# Altium schematic sheet Schematic_nanopad-retro.schdoc
size 410 x 288 mm
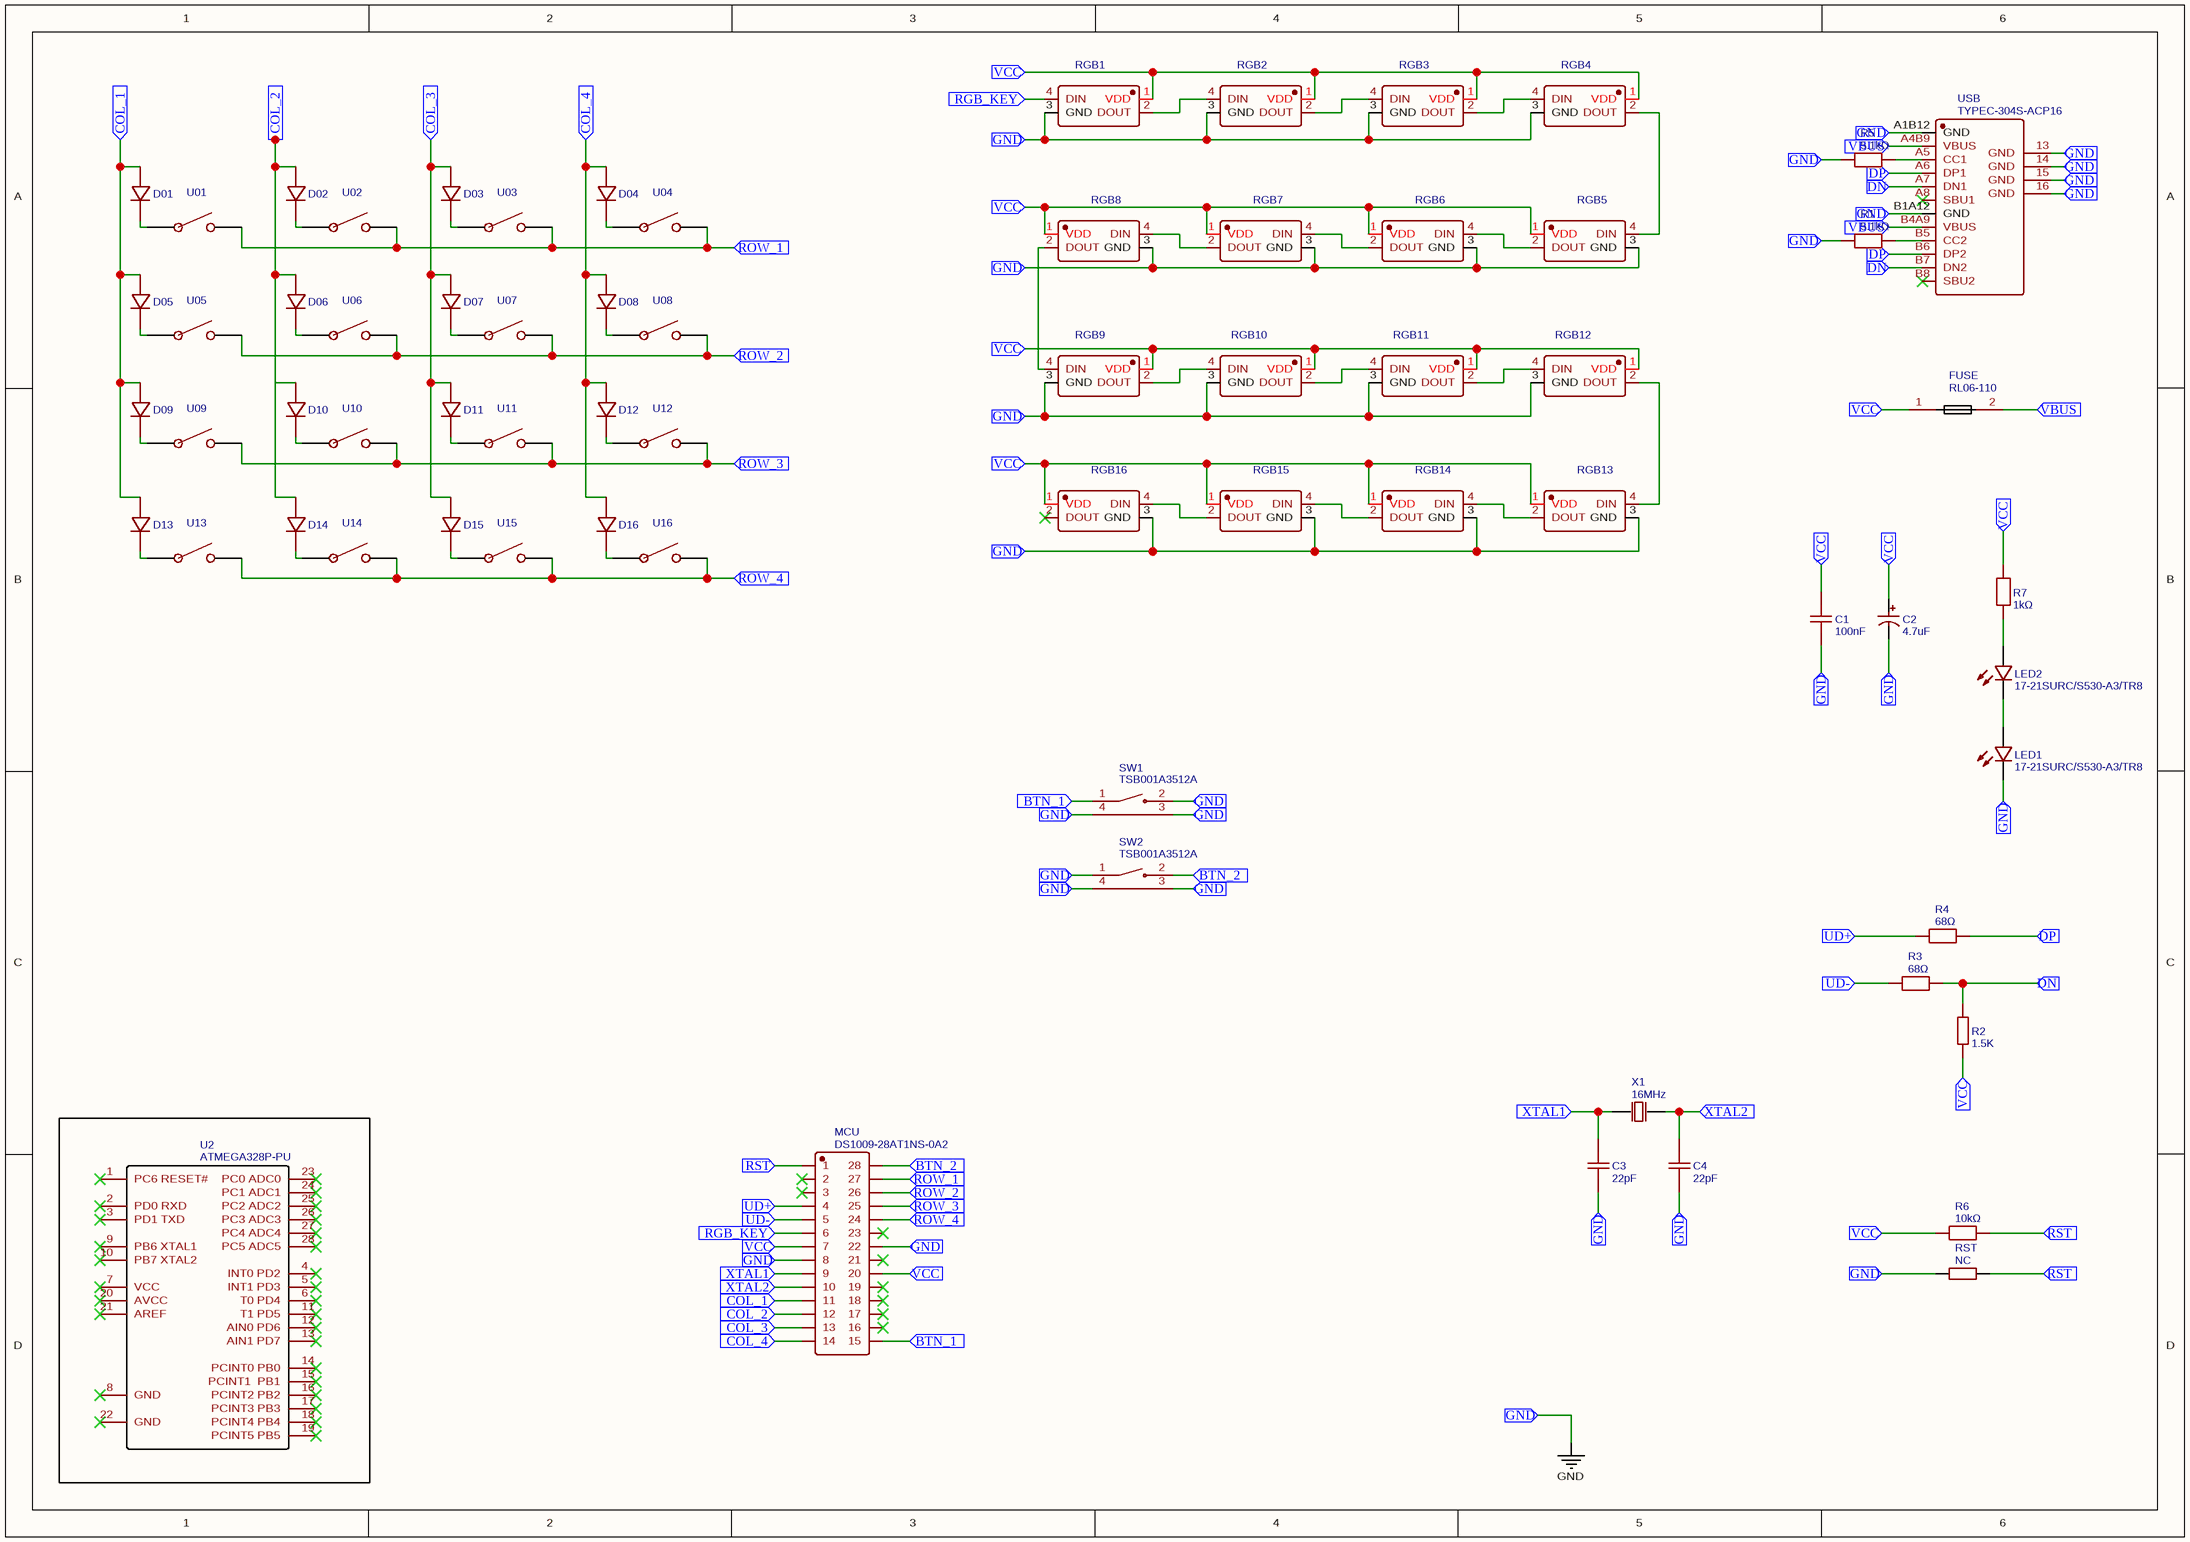
[diagram p0: Schematic_nanopad-retro.schdoc]

## Parts
C1  100nF  [CAP-TH_L7.2-W2.5-P5.00-D0.6]
C2  4.7uF  [CAP-TH_BD5.0-P2.00-D0.8-FD]
C3  22pF  [CAP-TH_L6.5-W3.5-P5.00-D1.2]
C4  22pF  [CAP-TH_L6.5-W3.5-P5.00-D1.2]
D01  1N4148_C402212  [DO-35_BD2.0-L4.2-P8.20-D0.5-RD]  (value not drawn)
D02  1N4148_C402212  [DO-35_BD2.0-L4.2-P8.20-D0.5-RD]  (value not drawn)
D03  1N4148_C402212  [DO-35_BD2.0-L4.2-P8.20-D0.5-RD]  (value not drawn)
D04  1N4148_C402212  [DO-35_BD2.0-L4.2-P8.20-D0.5-RD]  (value not drawn)
D05  1N4148_C402212  [DO-35_BD2.0-L4.2-P8.20-D0.5-RD]  (value not drawn)
D06  1N4148_C402212  [DO-35_BD2.0-L4.2-P8.20-D0.5-RD]  (value not drawn)
D07  1N4148_C402212  [DO-35_BD2.0-L4.2-P8.20-D0.5-RD]  (value not drawn)
D08  1N4148_C402212  [DO-35_BD2.0-L4.2-P8.20-D0.5-RD]  (value not drawn)
D09  1N4148_C402212  [DO-35_BD2.0-L4.2-P8.20-D0.5-RD]  (value not drawn)
D10  1N4148_C402212  [DO-35_BD2.0-L4.2-P8.20-D0.5-RD]  (value not drawn)
D11  1N4148_C402212  [DO-35_BD2.0-L4.2-P8.20-D0.5-RD]  (value not drawn)
D12  1N4148_C402212  [DO-35_BD2.0-L4.2-P8.20-D0.5-RD]  (value not drawn)
D13  1N4148_C402212  [DO-35_BD2.0-L4.2-P8.20-D0.5-RD]  (value not drawn)
D14  1N4148_C402212  [DO-35_BD2.0-L4.2-P8.20-D0.5-RD]  (value not drawn)
D15  1N4148_C402212  [DO-35_BD2.0-L4.2-P8.20-D0.5-RD]  (value not drawn)
D16  1N4148_C402212  [DO-35_BD2.0-L4.2-P8.20-D0.5-RD]  (value not drawn)
FUSE  RL06-110  [FUSE-TH_L7.8-W3.0-P5.10-D0.5-S2.00]
LED1  17-21SURC/S530-A3/TR8  [LED0805-R-RD]
LED2  17-21SURC/S530-A3/TR8  [LED0805-R-RD]
MCU  DS1009-28AT1NS-0A2  [DIP-28_L35.6-W10.2-P2.54-LS7.6-BL-2]
R1  5.1kΩ  [RES-TH_BD2.3-L6.5-P10.50-D0.5]
R2  1.5K  [RES-TH_BD2.3-L6.5-P10.50-D0.5]
R3  68Ω  [RES-TH_BD2.3-L6.5-P10.50-D0.5]
R4  68Ω  [RES-TH_BD2.3-L6.5-P10.50-D0.5]
R5  5.1kΩ  [RES-TH_BD2.3-L6.5-P10.50-D0.5]
R6  10kΩ  [RES-TH_BD2.3-L6.5-P10.50-D0.5]
R7  1kΩ  [RES-TH_BD2.3-L6.5-P10.50-D0.5]
RGB1  YO-WS2812B-3528反贴雾状  [LED-SMD_L3.2-W2.8-BR_DY-S352818]  (value not drawn)
RGB2  YO-WS2812B-3528反贴雾状  [LED-SMD_L3.2-W2.8-BR_DY-S352818]  (value not drawn)
RGB3  YO-WS2812B-3528反贴雾状  [LED-SMD_L3.2-W2.8-BR_DY-S352818]  (value not drawn)
RGB4  YO-WS2812B-3528反贴雾状  [LED-SMD_L3.2-W2.8-BR_DY-S352818]  (value not drawn)
RGB5  YO-WS2812B-3528反贴雾状  [LED-SMD_L3.2-W2.8-BR_DY-S352818]  (value not drawn)
RGB6  YO-WS2812B-3528反贴雾状  [LED-SMD_L3.2-W2.8-BR_DY-S352818]  (value not drawn)
RGB7  YO-WS2812B-3528反贴雾状  [LED-SMD_L3.2-W2.8-BR_DY-S352818]  (value not drawn)
RGB8  YO-WS2812B-3528反贴雾状  [LED-SMD_L3.2-W2.8-BR_DY-S352818]  (value not drawn)
RGB9  YO-WS2812B-3528反贴雾状  [LED-SMD_L3.2-W2.8-BR_DY-S352818]  (value not drawn)
RGB10  YO-WS2812B-3528反贴雾状  [LED-SMD_L3.2-W2.8-BR_DY-S352818]  (value not drawn)
RGB11  YO-WS2812B-3528反贴雾状  [LED-SMD_L3.2-W2.8-BR_DY-S352818]  (value not drawn)
RGB12  YO-WS2812B-3528反贴雾状  [LED-SMD_L3.2-W2.8-BR_DY-S352818]  (value not drawn)
RGB13  YO-WS2812B-3528反贴雾状  [LED-SMD_L3.2-W2.8-BR_DY-S352818]  (value not drawn)
RGB14  YO-WS2812B-3528反贴雾状  [LED-SMD_L3.2-W2.8-BR_DY-S352818]  (value not drawn)
RGB15  YO-WS2812B-3528反贴雾状  [LED-SMD_L3.2-W2.8-BR_DY-S352818]  (value not drawn)
RGB16  YO-WS2812B-3528反贴雾状  [LED-SMD_L3.2-W2.8-BR_DY-S352818]  (value not drawn)
RST  NC  [R0603]
SW1  TSB001A3512A  [SW-SMD_TSB001XXXX]
SW2  TSB001A3512A  [SW-SMD_TSB001XXXX]
U01  热插拔轴座焊接_二极管  [热插拔轴座]  (value not drawn)
U2  ATMEGA328P-PU  [DIP-28_L34.6-W7.3-P2.54-LS10.2-BL]
U02  热插拔轴座焊接_二极管  [热插拔轴座]  (value not drawn)
U03  热插拔轴座焊接_二极管  [热插拔轴座]  (value not drawn)
U04  热插拔轴座焊接_二极管  [热插拔轴座]  (value not drawn)
U05  热插拔轴座焊接_二极管  [热插拔轴座]  (value not drawn)
U06  热插拔轴座焊接_二极管  [热插拔轴座]  (value not drawn)
U07  热插拔轴座焊接_二极管  [热插拔轴座]  (value not drawn)
U08  热插拔轴座焊接_二极管  [热插拔轴座]  (value not drawn)
U09  热插拔轴座焊接_二极管  [热插拔轴座]  (value not drawn)
U10  热插拔轴座焊接_二极管  [热插拔轴座]  (value not drawn)
U11  热插拔轴座焊接_二极管  [热插拔轴座]  (value not drawn)
U12  热插拔轴座焊接_二极管  [热插拔轴座]  (value not drawn)
U13  热插拔轴座焊接_二极管  [热插拔轴座]  (value not drawn)
U14  热插拔轴座焊接_二极管  [热插拔轴座]  (value not drawn)
U15  热插拔轴座焊接_二极管  [热插拔轴座]  (value not drawn)
U16  热插拔轴座焊接_二极管  [热插拔轴座]  (value not drawn)
USB  TYPEC-304S-ACP16  [USB-C-SMD_TYPEC-304S-ACP16]
X1  16MHz  [OSC-TH_L10.0-W4.5-P5.00]

## Ports
BTN_1 (in), BTN_2 (in), COL_1 (in), COL_2 (in), COL_3 (in), COL_4 (in), DN (in), DP (in), GND (in), RGB_KEY (in), ROW_1 (in), ROW_2 (in), ROW_3 (in), ROW_4 (in), RST (in), UD+ (in), UD- (in), VBUS (in), VCC (in), XTAL1 (in), XTAL2 (in)

## Nets
GND: C1.1 C2.2 C3.2 C4.1 LED1.2(C) MCU.8 MCU.22 R1.1 R5.1 RGB1.3(GND) RGB2.3(GND) RGB3.3(GND) RGB4.3(GND) RGB5.3(GND) RGB6.3(GND) RGB7.3(GND) RGB8.3(GND) RGB9.3(GND) RGB10.3(GND) RGB11.3(GND) RGB12.3(GND) RGB13.3(GND) RGB14.3(GND) RGB15.3(GND) RGB16.3(GND) RST.1 SW1.2 SW1.3 SW1.4 SW2.1 SW2.3 SW2.4 USB.13(GND) USB.14(GND) USB.15(GND) USB.16(GND) USB.A1B12(GND) USB.B1A12(GND) ; port GND
BTN_1: MCU.15 SW1.1 ; port BTN_1
BTN_2: MCU.28 SW2.2 ; port BTN_2
COL_1: D01.2(A) D05.2(A) D09.2(A) D13.2(A) MCU.11 ; port COL_1
COL_2: D02.2(A) D06.2(A) D10.2(A) D14.2(A) MCU.12 ; port COL_2
COL_3: D03.2(A) D07.2(A) D11.2(A) D15.2(A) MCU.13 ; port COL_3
COL_4: D04.2(A) D08.2(A) D12.2(A) D16.2(A) MCU.14 ; port COL_4
DN: R2.1 R3.2 USB.A7(DN1) USB.B7(DN2) ; port DN
DP: R4.2 USB.A6(DP1) USB.B6(DP2) ; port DP
RGB_KEY: MCU.6 RGB1.4(DIN) ; port RGB_KEY
ROW_1: MCU.27 U01.COL U02.COL U03.COL U04.COL ; port ROW_1
ROW_2: MCU.26 U05.COL U06.COL U07.COL U08.COL ; port ROW_2
ROW_3: MCU.25 U09.COL U10.COL U11.COL U12.COL ; port ROW_3
ROW_4: MCU.24 U13.COL U14.COL U15.COL U16.COL ; port ROW_4
RST: MCU.1 R6.2 RST.2 ; port RST
UD+: MCU.4 R4.1 ; port UD+
UD-: MCU.5 R3.1 ; port UD-
VBUS: FUSE.2 USB.A4B9(VBUS) USB.B4A9(VBUS) ; port VBUS
VCC: C1.2 C2.1 FUSE.1 MCU.7 MCU.20 R2.2 R6.1 R7.2 RGB1.1(VDD) RGB2.1(VDD) RGB3.1(VDD) RGB4.1(VDD) RGB5.1(VDD) RGB6.1(VDD) RGB7.1(VDD) RGB8.1(VDD) RGB9.1(VDD) RGB10.1(VDD) RGB11.1(VDD) RGB12.1(VDD) RGB13.1(VDD) RGB14.1(VDD) RGB15.1(VDD) RGB16.1(VDD) ; port VCC
XTAL1: C3.1 MCU.9 X1.2(OSC2) ; port XTAL1
XTAL2: C4.2 MCU.10 X1.1(OSC1) ; port XTAL2
NetD01_1: D01.1(C) U01.ROW
NetD02_1: D02.1(C) U02.ROW
NetD03_1: D03.1(C) U03.ROW
NetD04_1: D04.1(C) U04.ROW
NetD05_1: D05.1(C) U05.ROW
NetD06_1: D06.1(C) U06.ROW
NetD07_1: D07.1(C) U07.ROW
NetD08_1: D08.1(C) U08.ROW
NetD09_1: D09.1(C) U09.ROW
NetD10_1: D10.1(C) U10.ROW
NetD11_1: D11.1(C) U11.ROW
NetD12_1: D12.1(C) U12.ROW
NetD13_1: D13.1(C) U13.ROW
NetD14_1: D14.1(C) U14.ROW
NetD15_1: D15.1(C) U15.ROW
NetD16_1: D16.1(C) U16.ROW
NetLED1_1: LED1.1(A) LED2.2(C)
NetLED2_1: LED2.1(A) R7.1
NetR1_2: R1.2 USB.B5(CC2)
NetR5_2: R5.2 USB.A5(CC1)
NetRGB1_2: RGB1.2(DOUT) RGB2.4(DIN)
NetRGB2_2: RGB2.2(DOUT) RGB3.4(DIN)
NetRGB3_2: RGB3.2(DOUT) RGB4.4(DIN)
NetRGB4_2: RGB4.2(DOUT) RGB5.4(DIN)
NetRGB5_2: RGB5.2(DOUT) RGB6.4(DIN)
NetRGB6_2: RGB6.2(DOUT) RGB7.4(DIN)
NetRGB7_2: RGB7.2(DOUT) RGB8.4(DIN)
NetRGB8_2: RGB8.2(DOUT) RGB9.4(DIN)
NetRGB9_2: RGB9.2(DOUT) RGB10.4(DIN)
NetRGB10_2: RGB10.2(DOUT) RGB11.4(DIN)
NetRGB11_2: RGB11.2(DOUT) RGB12.4(DIN)
NetRGB12_2: RGB12.2(DOUT) RGB13.4(DIN)
NetRGB13_2: RGB13.2(DOUT) RGB14.4(DIN)
NetRGB14_2: RGB14.2(DOUT) RGB15.4(DIN)
NetRGB15_2: RGB15.2(DOUT) RGB16.4(DIN)

Not connected (* = marked no-connect by the designer): MCU 2* 3* 16* 17* 18* 19* 21* 23*; RGB16 2(DOUT)*; U2 1(PC6_RESET#)* 2(PD0_RXD)* 3(PD1_TXD)* 4(INT0_PD2)* 5(INT1_PD3)* 6(T0_PD4)* 7(VCC)* 8(GND)* 9(PB6_XTAL1)* 10(PB7_XTAL2)* 11(T1_PD5)* 12(AIN0_PD6)* 13(AIN1_PD7)* 14(PCINT0_PB0)* 15(PCINT1__PB1)* 16(PCINT2_PB2)* 17(PCINT3_PB3)* 18(PCINT4_PB4)* 19(PCINT5_PB5)* 20(AVCC)* 21(AREF)* 22(GND)* 23(PC0_ADC0)* 24(PC1_ADC1)* 25(PC2_ADC2)* 26(PC3_ADC3)* 27(PC4_ADC4)* 28(PC5_ADC5)*; USB A8(SBU1)* B8(SBU2)*

## Library data of the parts
C1 = 100nF: BOM_Manufacturer: Hongzhi Elec; BOM_Manufacturer Part: MEM104J2A-7-50R0; nameAlias: Capacitance; Contributor: LCSC; BOM_Supplier: LCSC; BOM_Supplier Part: C333838; BOM_JLCPCB Part Class: Extended Part; spicePre: C; spiceSymbolName: MEM104J2A-7-50R0
C2 = 4.7uF: BOM_Manufacturer: Rubycon; BOM_Manufacturer Part: 50YXF4R7MEFC5X11; nameAlias: Capacitance; BOM_Supplier: LCSC; BOM_Supplier Part: C88759; BOM_JLCPCB Part Class: Extended Part; spicePre: C; spiceSymbolName: 50YXF4R7MEFC5X11
C3 C4 = 22pF: BOM_Manufacturer: Guangdong Fenghua Advanced Tech; BOM_Manufacturer Part: CC81-N5U2J1B220KSEW; nameAlias: Capacitance; Contributor: LCSC; BOM_Supplier: LCSC; BOM_Supplier Part: C278005; BOM_JLCPCB Part Class: Extended Part; spicePre: C; spiceSymbolName: CC81-N5U2J1B220KSEW
D01 D02 D03 D04 D05 D06 D07 D08 D09-D16 = 1N4148_C402212: BOM_Manufacturer: LGE; BOM_Manufacturer Part: 1N4148; Contributor: LCSC; BOM_Supplier: LCSC; BOM_Supplier Part: C402212; BOM_JLCPCB Part Class: Extended Part; spicePre: D; spiceSymbolName: 1N4148_C402212
FUSE = RL06-110: BOM_Manufacturer: RUILON; BOM_Supplier: LCSC; BOM_Manufacturer Part: RL06-110; BOM_Supplier Part: C20831; BOM_JLCPCB Part Class: Extended Part; spicePre: F; spiceSymbolName: RL06-110
LED1 LED2 = 17-21SURC/S530-A3/TR8: BOM_Manufacturer: EVERLIGHT; BOM_Supplier: LCSC; BOM_Manufacturer Part: 17-21SURC/S530-A3/TR8; BOM_Supplier Part: C72037; BOM_JLCPCB Part Class: Extended Part; spicePre: L; spiceSymbolName: 17-21SURC/S530-A3/TR8
MCU = DS1009-28AT1NS-0A2: BOM_Manufacturer: CONNFLY; Contributor: LCSC; BOM_Supplier: LCSC; BOM_Manufacturer Part: DS1009-28AT1NS-0A2; BOM_Supplier Part: C72125; BOM_JLCPCB Part Class: Extended Part; spicePre: U; spiceSymbolName: DS1009-28AT1NS-0A2
R1 R5 = 5.1kΩ: BOM_Manufacturer: Huaxing Mechanical-Elec.; BOM_Manufacturer Part: MF1/4W-5.1KΩ±1%T52; nameAlias: Resistance (Ohms); Contributor: LCSC; BOM_Supplier: LCSC; BOM_Supplier Part: C714010; BOM_JLCPCB Part Class: Extended Part; Resistance: 5.1kΩ; spicePre: R; spiceSymbolName: MF1/4W-5.1KΩ±1%T52
R2 = 1.5K: BOM_Manufacturer: Chian Chia Elec; nameAlias: Resistance (Ohms); Contributor: LCSC; Resistance: 1.5kΩ; BOM_Supplier: LCSC; BOM_Supplier Part: C120059; BOM_Manufacturer Part: -; BOM_JLCPCB Part Class: Extended Part; spicePre: R; spiceSymbolName: CF1/4W-1.5KΩ±5% T52
R3 R4 = 68Ω: BOM_Manufacturer: Huaxing Mechanical-Elec.; BOM_Manufacturer Part: MF1/4W-68Ω±1%T52; nameAlias: Resistance (Ohms); Contributor: LCSC; BOM_Supplier: LCSC; BOM_Supplier Part: C713975; Resistance: 68Ω; BOM_JLCPCB Part Class: Extended Part; spicePre: R; spiceSymbolName: MF1/4W-68Ω±1%T52
R6 = 10kΩ: nameAlias: Resistance (Ohms); Contributor: LCSC; BOM_Supplier: LCSC; BOM_JLCPCB Part Class: Extended Part; Resistance: 10kΩ; spicePre: R; spiceSymbolName: MF1/4W-5.1KΩ±1%T52
R7 = 1kΩ: nameAlias: Resistance (Ohms); Contributor: LCSC; BOM_Supplier: LCSC; BOM_JLCPCB Part Class: Extended Part; Resistance: 1kΩ; spicePre: R; spiceSymbolName: MF1/4W-5.1KΩ±1%T52
RGB1-RGB16 = YO-WS2812B-3528反贴雾状: BOM_Manufacturer: null; Contributor: iceleve; BOM_Supplier: LCSC; BOM_Supplier Part: C9900003682; BOM_Manufacturer Part: Yo-WS2812B-3528反贴雾状; BOM_JLCPCB Part Class: Extended Part; spicePre: U; spiceSymbolName: YO-WS2812B-3528反贴雾状
RST = NC: BOM_Manufacturer: YAGEO; BOM_Manufacturer Part: RC0603JR-070RL; nameAlias: Resistance (Ohms); BOM_Supplier: LCSC; BOM_Supplier Part: C95177; BOM_JLCPCB Part Class: Extended Part; Resistance: NC; spicePre: R; spiceSymbolName: RC0603JR-070RL
SW1 SW2 = TSB001A3512A: BOM_Manufacturer: BZCN(博众电气); Contributor: LCSC; BOM_Supplier: LCSC; BOM_Supplier Part: C2888948; BOM_Manufacturer Part: TSB001A3512A; spicePre: S; spiceSymbolName: TSB001A3512A
U01 U02 U03 U04 U05 U06 U07 U08 U09-U16 = 热插拔轴座焊接_二极管: Contributor: shaoqing; spicePre: U; spiceSymbolName: 热插拔轴座焊接_二极管
U2 = ATMEGA328P-PU: BOM_Manufacturer: MICROCHIP; sourceId: Oic6oiASL; Contributor: LCSC; timeStamp: 1451725987; BOM_Supplier: LCSC; BOM_Manufacturer Part: ATMEGA328P-PU; BOM_Supplier Part: C33901; BOM_JLCPCB Part Class: Extended Part; spicePre: U; spiceSymbolName: ATMEGA328P-PU
USB = TYPEC-304S-ACP16: BOM_Manufacturer: XUNPU; Contributor: LCSC; BOM_Supplier: LCSC; BOM_Supplier Part: C720630; BOM_Manufacturer Part: TYPEC-304S-ACP16; BOM_JLCPCB Part Class: Extended Part; spicePre: U; spiceSymbolName: TYPEC-304S-ACP16
X1 = 16MHz: BOM_Manufacturer: YXC; BOM_Manufacturer Part: X49SD16MSD2SC; nameAlias: Frequency; BOM_Supplier: LCSC; BOM_Supplier Part: C16212; BOM_JLCPCB Part Class: Extended Part; spicePre: X; spiceSymbolName: X49SD16MSD2SC